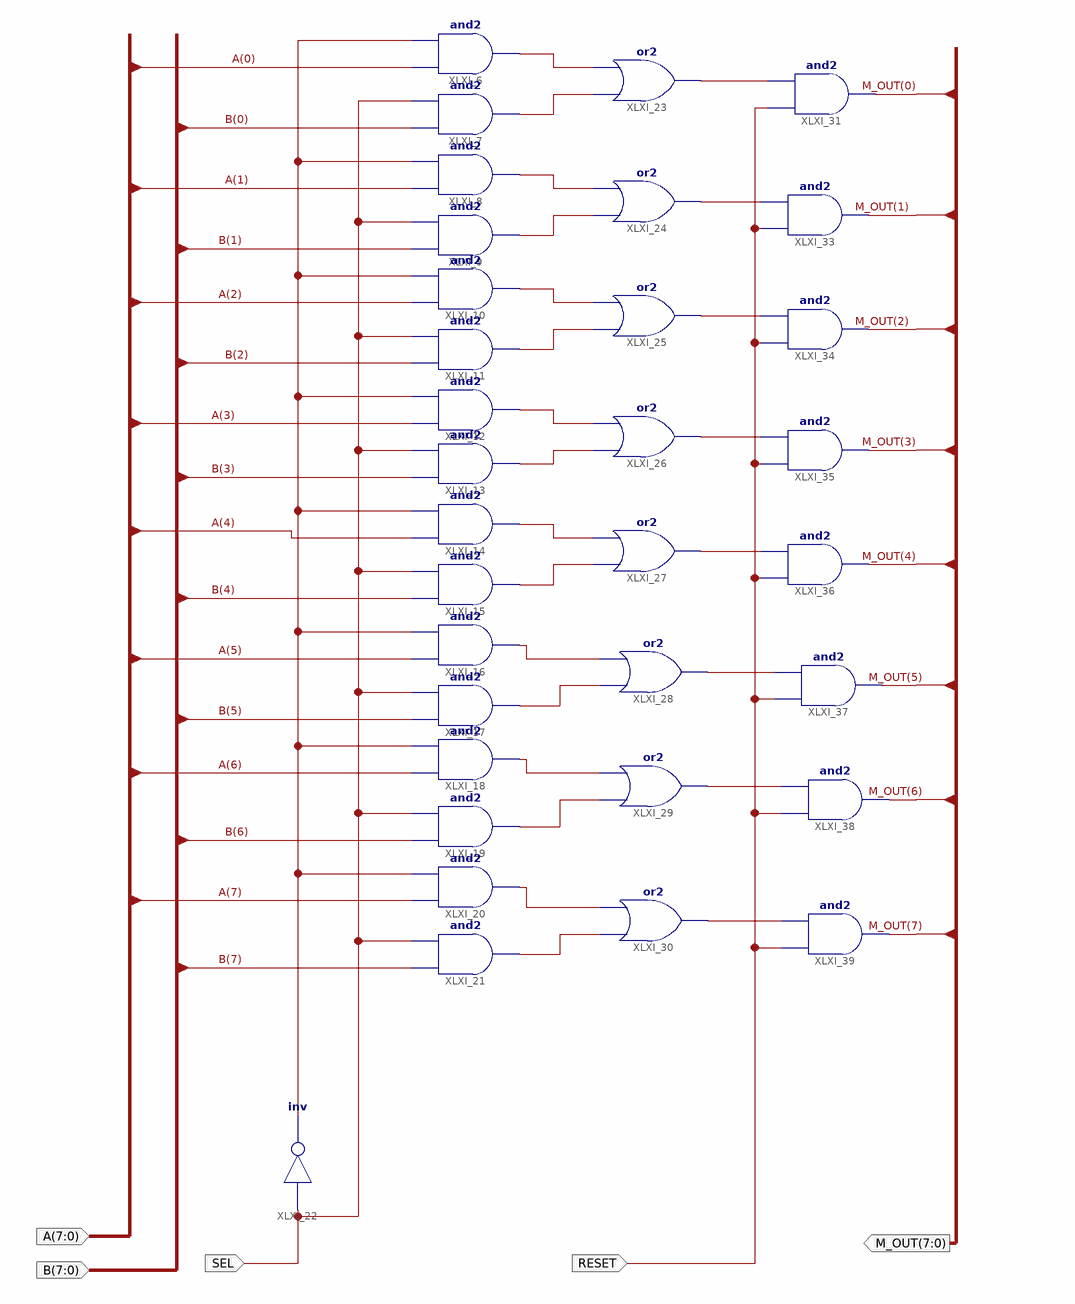
[diagram p0: schematic sheet 1]
// Xilinx ISE schematic Two_One_MUX_Eight_Bit_All_Ports.sch (spartan6) as structural Verilog: 33 symbols, 5 ports
module Two_One_MUX_Eight_Bit_All_Ports (
  input  SEL,
  input  [7:0] A,
  input  [7:0] B,
  input  RESET,
  output [7:0] M_OUT
);

  wire XLXN_4, XLXN_9, XLXN_10, XLXN_11, XLXN_12, XLXN_13, XLXN_14, XLXN_15, XLXN_16, XLXN_17, XLXN_46,
       XLXN_49, XLXN_50, XLXN_52, XLXN_53, XLXN_55, XLXN_56, XLXN_57, XLXN_58, XLXN_59, XLXN_60, XLXN_61,
       XLXN_62, XLXN_63, XLXN_65;

  and XLXI_6 (XLXN_9, A[0], XLXN_4);
  and XLXI_7 (XLXN_10, B[0], SEL);
  and XLXI_8 (XLXN_11, A[1], XLXN_4);
  and XLXI_9 (XLXN_12, B[1], SEL);
  and XLXI_10 (XLXN_13, A[2], XLXN_4);
  and XLXI_11 (XLXN_14, B[2], SEL);
  and XLXI_12 (XLXN_15, A[3], XLXN_4);
  and XLXI_13 (XLXN_16, B[3], SEL);
  and XLXI_14 (XLXN_17, A[4], XLXN_4);
  and XLXI_15 (XLXN_46, B[4], SEL);
  and XLXI_16 (XLXN_49, A[5], XLXN_4);
  and XLXI_17 (XLXN_50, B[5], SEL);
  and XLXI_18 (XLXN_52, A[6], XLXN_4);
  and XLXI_19 (XLXN_53, B[6], SEL);
  and XLXI_20 (XLXN_55, A[7], XLXN_4);
  and XLXI_21 (XLXN_56, B[7], SEL);
  or XLXI_23 (XLXN_57, XLXN_10, XLXN_9);
  or XLXI_24 (XLXN_58, XLXN_12, XLXN_11);
  or XLXI_25 (XLXN_59, XLXN_14, XLXN_13);
  or XLXI_26 (XLXN_60, XLXN_16, XLXN_15);
  or XLXI_27 (XLXN_61, XLXN_46, XLXN_17);
  or XLXI_28 (XLXN_63, XLXN_50, XLXN_49);
  or XLXI_29 (XLXN_62, XLXN_53, XLXN_52);
  or XLXI_30 (XLXN_65, XLXN_56, XLXN_55);
  and XLXI_31 (M_OUT[0], RESET, XLXN_57);
  and XLXI_33 (M_OUT[1], RESET, XLXN_58);
  and XLXI_34 (M_OUT[2], RESET, XLXN_59);
  and XLXI_35 (M_OUT[3], RESET, XLXN_60);
  and XLXI_36 (M_OUT[4], RESET, XLXN_61);
  and XLXI_37 (M_OUT[5], RESET, XLXN_63);
  and XLXI_38 (M_OUT[6], RESET, XLXN_62);
  and XLXI_39 (M_OUT[7], RESET, XLXN_65);
  not XLXI_22 (XLXN_4, SEL);
endmodule
